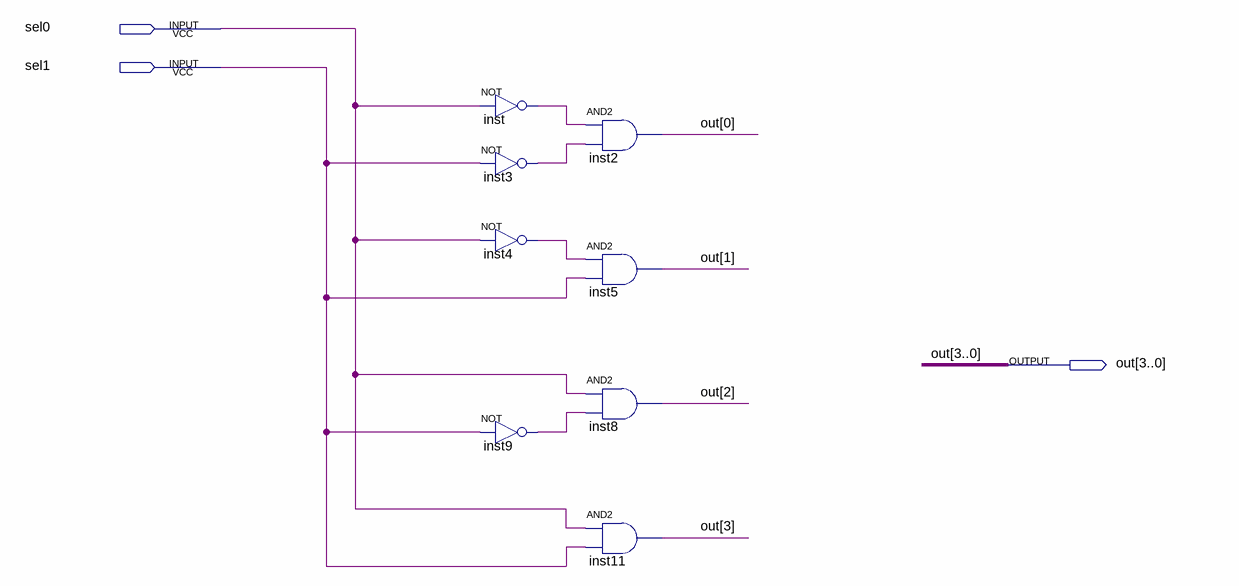
[diagram p0: schematic sheet]
// Quartus schematic DECODE4.bdf as structural Verilog: 8 symbols, 3 pins
module DECODE4 (
  input  sel0,
  input  sel1,
  output [3:0] out
);

  wire inst3_out, inst4_out, inst9_out, inst_out;

  not inst (inst_out, sel0);
  not inst3 (inst3_out, sel1);
  not inst4 (inst4_out, sel0);
  not inst9 (inst9_out, sel1);
  and inst2 (out[0], inst_out, inst3_out);
  and inst5 (out[1], inst4_out, sel1);
  and inst8 (out[2], sel0, inst9_out);
  and inst11 (out[3], sel0, sel1);
endmodule
